# EAGLE schematic VMU1 (EAGLE 7.2.0)
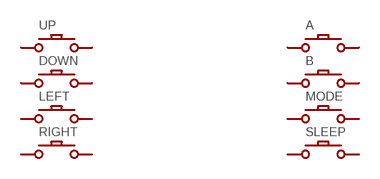
[diagram p0: schematic, sheet 1]

## Parts
A  DMG-BTNDS-BUTTON  [DS-LITE-BTN]
B  DMG-BTNDS-BUTTON  [DS-LITE-BTN]
DOWN  DMG-BTNDPAD  [DS-LITE-DPAD]
LEFT  DMG-BTNDPAD  [DS-LITE-DPAD]
MODE  DMG-BTNDS-BUTTON  [DS-LITE-BTN]
RIGHT  DMG-BTNDPAD  [DS-LITE-DPAD]
SLEEP  DMG-BTNDS-BUTTON  [DS-LITE-BTN]
UP  DMG-BTNDPAD  [DS-LITE-DPAD]
Unconnected: A.P$3 A.P$4 B.P$3 B.P$4 DOWN.P$3 DOWN.P$4 LEFT.P$3 LEFT.P$4 MODE.P$3 MODE.P$4 RIGHT.P$3 RIGHT.P$4 SLEEP.P$3 SLEEP.P$4 UP.P$3 UP.P$4

## Library data of the parts
A B DOWN LEFT MODE RIGHT SLEEP UP = Game Boy:DMG-BTN